# EAGLE schematic pocket_scope_dso_quad_fe_v0001 (EAGLE 6.4)
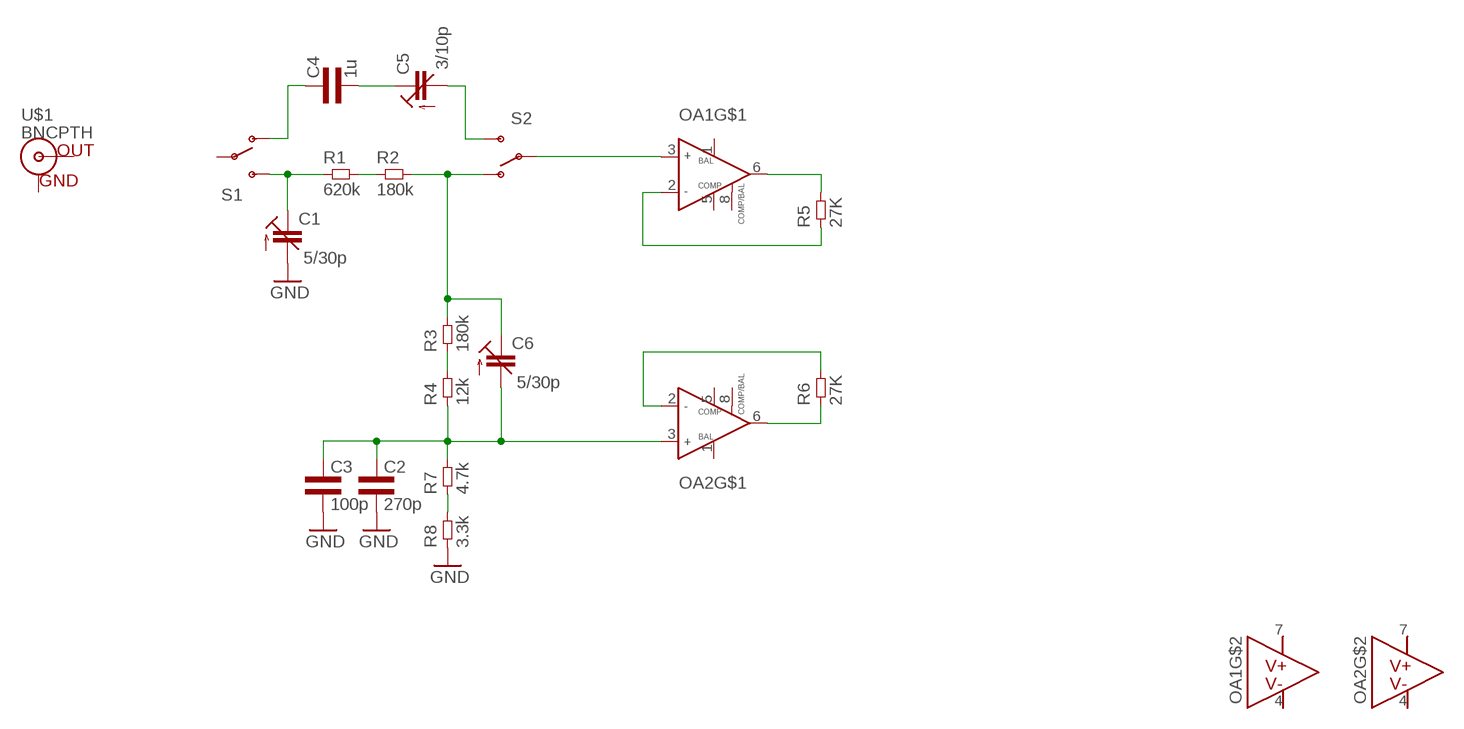
[diagram p0: schematic, sheet 1]

## Parts
C1  5/30p  C-TRIMM3018_11  [CTRIM3018_11]
C2  270p  CAP0603L3  [0603L3]
C3  100p  CAP0603L3  [0603L3]
C4  1u  CAP0603L3  [0603L3]
C5  3/10p  C-TRIMM3018_11  [CTRIM3018_11]
C6  5/30p  C-TRIMM3018_11  [CTRIM3018_11]
OA1  NE5534SOIC8  [SOIC-8]
OA2  NE5534SOIC8  [SOIC-8]
R1  620k  RES0603L3  [0603L3]
R2  180k  RES0603L3  [0603L3]
R3  180k  RES0603L3  [0603L3]
R4  12k  RES0603L3  [0603L3]
R5  27K  RES0603L3  [0603L3]
R6  27K  RES0603L3  [0603L3]
R7  4.7k  RES0603L3  [0603L3]
R8  3.3k  RES0603L3  [0603L3]
S1  SPARKFUN-ELECTROMECHANICAL_SWITCH-SPDTPTH_LOCK  [SPARKFUN-ELECTROMECHANICAL_SWITCH-SPDT_LOCK.007S]
S2  SPARKFUN-ELECTROMECHANICAL_SWITCH-SPDTPTH_LOCK  [SPARKFUN-ELECTROMECHANICAL_SWITCH-SPDT_LOCK.007S]
U$1  BNCPTH  [BNC]

## Nets
GND: C1.-(A) C2.P$2 C3.P$2 R8.P$1
N$1: C1.+(E) R1.P$1 S1.3(S)
N$2: R1.P$2 R2.P$1
N$3: C6.+(E) R2.P$2 R3.P$2 S2.1(O)
N$4: OA1.3(IN+) S2.2(P)
N$5: R3.P$1 R4.P$2
N$6: C2.P$1 C3.P$1 C6.-(A) OA2.3(IN+) R4.P$1 R7.P$2
N$7: OA1.2(IN-) R5.P$1
N$8: OA2.2(IN-) R6.P$2
N$9: OA2.6(OUT) R6.P$1
N$10: OA1.6(OUT) R5.P$2
N$11: R7.P$1 R8.P$2
N$12: C5.-(A) S2.3(S)
N$13: C4.P$1 S1.1(O)
N$14: C4.P$2 C5.+(E)
Unconnected: OA1.1(BAL) OA1.5(COMP) OA1.8(COMP/BAL) OA2.1(BAL) OA2.5(COMP) OA2.8(COMP/BAL) S1.2(P) U$1.GND U$1.S(OUT)

## Power pins joined to a net without a drawn wire
V+: OA1.7(V+) OA2.7(V+)
V-: OA1.4(V-) OA2.4(V-)

## Library data of the parts
C1 C5 C6 = resistor:C-TRIMM: Trimm capacitor
C2-C4 = common:CAP
OA1 OA2 = common:NE5534: Low-noise, high-SP audio Op Amp.
R1-R8 = common:RES
S1 S2 = my_dac_amp:SPARKFUN-ELECTROMECHANICAL_SWITCH-SPDT: SPDT Switch Simple slide switch, Spark Fun Electronics SKU : COM-00102 DPDT SMT slide switch, AYZ0202, SWCH-08179
U$1 = SparkFun-Connectors:BNC: BNC Connector, Mouser Part# 5227161